# Altium schematic sheet BuoyLoRaNode_Schematic.SchDoc
size Letter
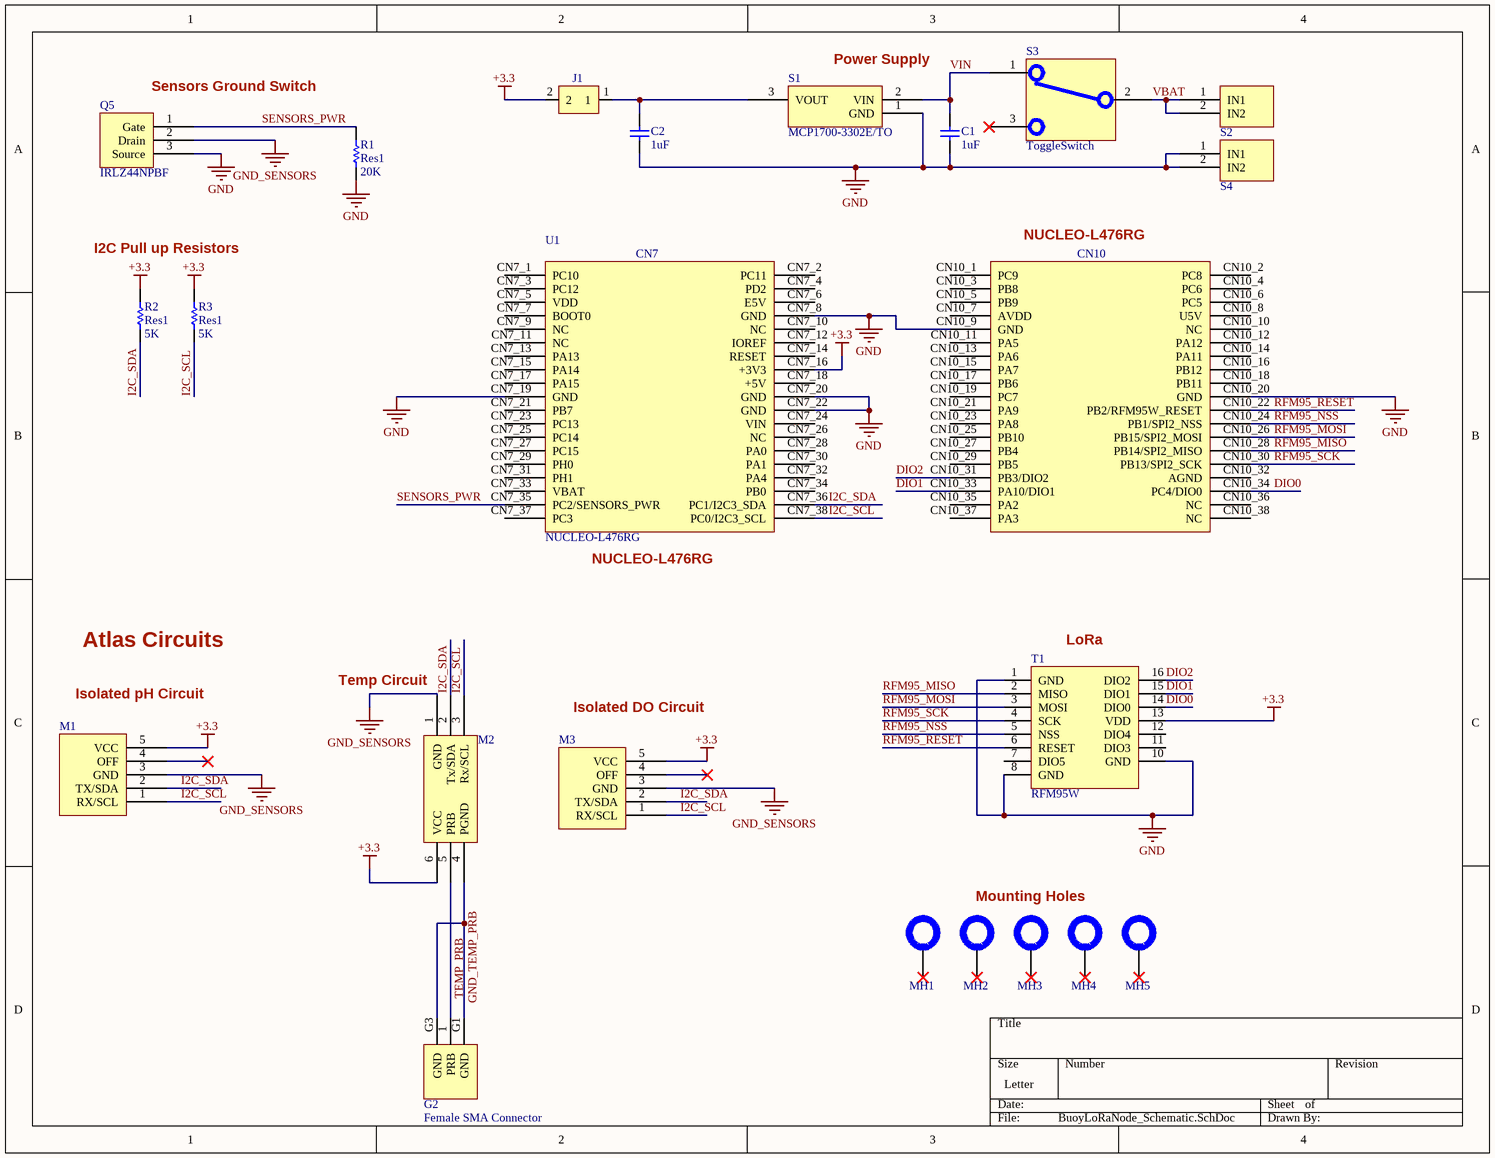
[diagram p0: BuoyLoRaNode_Schematic.SchDoc]

## Parts
C1  1uF  [C1uFTantalum]
C2  1uF  [C1uFTantalum]
G2  Female SMA Connector  [SmaFemaleConnectorEdgeMount]
J1  2PinMaleJumper  [2MaleJumper]  (value not drawn)
M1  Isolated pH Sensor  [ATLASISOLATEDPHSENSOR]  (value not drawn)
M2  EZO™ RTD Temperature Circuit  [AtlasTemperatureSensor]  (value not drawn)
M3  Isolated DO Sensor  [ATLASISOLATEDDOSENSOR]  (value not drawn)
MH1  MountingHole_3.4mmHole  [MountingHole]  (value not drawn)
MH2  MountingHole_3.4mmHole  [MountingHole]  (value not drawn)
MH3  MountingHole_3.4mmHole  [MountingHole]  (value not drawn)
MH4  MountingHole_3.4mmHole  [MountingHole]  (value not drawn)
MH5  MountingHole_3.4mmHole  [MountingHole]  (value not drawn)
Q5  IRLZ44NPBF  [IRLZ44N]
R1  Res1  value 20K  [AXIAL-0.3]
R2  Res1  value 5K  [AXIAL-0.3]
R3  Res1  value 5K  [AXIAL-0.3]
S1  MCP1700-3302E/TO  [MCP1700]
S2  2PositionScrewTerminal  [2POSITIONSCREWTERMINAL]  (value not drawn)
S3  ToggleSwitch  [ToggleSwitch]
S4  2PositionScrewTerminal  [2POSITIONSCREWTERMINAL]  (value not drawn)
T1  RFM95W  [RFM95WBreakout]
U1  NUCLEO-L476RG  [NUCLEOL476RG]

## Nets
+3.3: J1.2 M1.5(VCC) M2.6(VCC) M3.5(VCC) R2.2 R3.2 T1.13(VDD) U1.CN7_16(+3V3)
GND: C1.1 C2.1 Q5.3(Source) R1.1 S1.1(GND) S4.1(IN1) S4.2(IN2) T1.1(GND) T1.8(GND) T1.10(GND) U1.CN7_8(GND) U1.CN7_19(GND) U1.CN7_20(GND) U1.CN7_22(GND) U1.CN10_9(GND) U1.CN10_20(GND)
GND_SENSORS: M1.3(GND) M2.1(GND) M3.3(GND) Q5.2(Drain)
DIO0: T1.14(DIO0) U1.CN10_34(PC4/DIO0)
DIO1: T1.15(DIO1) U1.CN10_33(PA10/DIO1)
DIO2: T1.16(DIO2) U1.CN10_31(PB3/DIO2)
GND_TEMP_PRB: G2.G1(GND) G2.G3(GND) M2.4(PGND)
I2C_SCL: M1.1(RX/SCL) M2.3(Rx/SCL) M3.1(RX/SCL) R3.1 U1.CN7_38(PC0/I2C3_SCL)
I2C_SDA: M1.2(TX/SDA) M2.2(Tx/SDA) M3.2(TX/SDA) R2.1 U1.CN7_36(PC1/I2C3_SDA)
RFM95_MISO: T1.2(MISO) U1.CN10_28(PB14/SPI2_MISO)
RFM95_MOSI: T1.3(MOSI) U1.CN10_26(PB15/SPI2_MOSI)
RFM95_NSS: T1.5(NSS) U1.CN10_24(PB1/SPI2_NSS)
RFM95_RESET: T1.6(RESET) U1.CN10_22(PB2/RFM95W_RESET)
RFM95_SCK: T1.4(SCK) U1.CN10_30(PB13/SPI2_SCK)
SENSORS_PWR: Q5.1(Gate) R1.2 U1.CN7_35(PC2/SENSORS_PWR)
TEMP_PRB: G2.1(PRB) M2.5(PRB)
VBAT: S2.1(IN1) S2.2(IN2) S3.2(COM)
VIN: C1.2 S1.2(VIN) S3.1(L1)
NetC2_2: C2.2 J1.1 S1.3(VOUT)

Not connected (* = marked no-connect by the designer): M1 4(OFF)*; M3 4(OFF)*; MH1 1*; MH2 1*; MH3 1*; MH4 1*; MH5 1*; S3 3(L2)*; T1 7(DIO5) 11(DIO3) 12(DIO4); U1 CN7_1(PC10) CN7_2(PC11) CN7_3(PC12) CN7_4(PD2) CN7_5(VDD) CN7_6(E5V) CN7_7(BOOT0) CN7_9(NC) CN7_10(NC) CN7_11(NC) CN7_12(IOREF) CN7_13(PA13) CN7_14(RESET) CN7_15(PA14) CN7_17(PA15) CN7_18(+5V) CN7_21(PB7) CN7_23(PC13) CN7_24(VIN) CN7_25(PC14) CN7_26(NC) CN7_27(PC15) CN7_28(PA0) CN7_29(PH0) CN7_30(PA1) CN7_31(PH1) CN7_32(PA4) CN7_33(VBAT) CN7_34(PB0) CN7_37(PC3) CN10_1(PC9) CN10_2(PC8) CN10_3(PB8) CN10_4(PC6) CN10_5(PB9) CN10_6(PC5) CN10_7(AVDD) CN10_8(U5V) CN10_10(NC) CN10_11(PA5) CN10_12(PA12) CN10_13(PA6) CN10_14(PA11) CN10_15(PA7) CN10_16(PB12) CN10_17(PB6) CN10_18(PB11) CN10_19(PC7) CN10_21(PA9) CN10_23(PA8) CN10_25(PB10) CN10_27(PB4) CN10_29(PB5) CN10_32(AGND) CN10_35(PA2) CN10_36(NC) CN10_37(PA3) CN10_38(NC)

## Notes on the sheet
- (near Q5) Sensors Ground Switch
- (near S1) Power Supply
- (near U1) NUCLEO-L476RG
- I2C Pull up Resistors
- Atlas Circuits
- (near T1) LoRa
- (near M1) Isolated pH Circuit
- (near M2) Temp Circuit
- (near M3) Isolated DO Circuit
- Mounting Holes
- (in symbol NUCLEO-L476RG) CN7; CN10

## Library data of the parts
C1 C2 = T350A105K035AS7301: CAP TANT 1UF 10% 35V RADIAL; Manufacturer: KEMET; ESR (Equivalent Series Resistance): 8R; Leakage Current: 500nA; Polarity: Polar; Dissipation Factor: 3%; Lead Diameter: 0.5mm; Supplier 1: Digi-Key; Manufacturer Part Number: T350A105K035AS7301; RoHS: No; Category: Tantalum Capacitors; Stock 1: 8816; Pricing 1: 1=1.46000, 10=1.15200, 50=0.99820, 100=0.86380, 500=0.65264 (USD); Case/Package: Dipped; Min Operating Temperature: -55°C; Max Operating Temperature: 125°C; Packaging: Tape and Reel; Capacitance: 1uF; Voltage Rating: 35V; Tolerance: 10%; Voltage Rating (DC): 35V; Termination: Radial; Series: T35X; Construction: RADIAL; Diameter: 4.5mm; Height: 7.1mm; Lead Pitch: 2.54mm; RoHS Compliant: No; ComponentLink1URL: http://www.mouser.com/ds/2/212/F3100-1140474.pdf?src-supplier=Mouser; ComponentLink1Description: http://www.mouser.com/ds/2/212/F3100-1140474.pdf?src-supplier=Mouser; ComponentLink2URL: http://components.arrow.com/part/dataview/0323_00403401?src-supplier=Arrow+Europe; ComponentLink2Description: http://components.arrow.com/part/dataview/0323_00403401?src-supplier=Arrow+Europe; ComponentLink3URL: https://api.kemet.com/component-edge/download/datasheet/T350A105K035AS7301.pdf?src-supplier=Digi-Key; ComponentLink3Description: https://api.kemet.com/component-edge/download/datasheet/T350A105K035AS7301.pdf?src-supplier=Digi-Key; Supplier Part Number 1: 399-18004-1-ND
M1 = Atlas Isolated pH Sensor
M3 = Atlas Isolated DO Sensor
MH1-MH5 = MountingHole
Q5 = IRLZ44NPBF: INFINEON - IRLZ44NPBF - MOSFET, N, 55V, 41A, TO-220; Manufacturer: International Rectifier; Continuous Drain Current (ID): 47A; Gate to Source Voltage (Vgs): 16V; Rise Time: 84ns; Number of Elements: 1; Drain to Source Resistance: 35mR; Power Dissipation: 110W; Turn-On Delay Time: 11ns; Turn-Off Delay Time: 26ns; Fall Time: 15ns; Drain-source On Resistance-Max: 22mR; Input Capacitance: 1.7nF; Nominal Vgs: 2V; Recovery Time: 120ns; Element Configuration: Single; Supplier 1: Newark; Manufacturer Part Number: IRLZ44NPBF; RoHS: Yes; Category: MOSFETs; Mount: Through Hole; Case/Package: TO-220AB; Number of Pins: 3; Min Operating Temperature: -55°C; Max Operating Temperature: 175°C; Drain to Source Voltage (Vdss): 55V; Max Power Dissipation: 110W; Package Quantity: 50; Packaging: Rail/Tube; Rds On Max: 22mR; Drain to Source Breakdown Voltage: 55V; On-State Resistance: 22mR; Series: HEXFET®; Dual Supply Voltage: 55V; Voltage Rating (DC): 55V; Current Rating: 47A; Length: 10.54mm; Width: 4.69mm; Height: 8.77mm; Lead Pitch: 2.54mm; Radiation Hardening: No; RoHS Compliant: Yes; Lead Free: Lead Free; REACH SVHC: No SVHC; ComponentLink1URL: https://datasheet.ciiva.com/19479/1563905-19479714.pdf?src-supplier=Jameco; ComponentLink1Description: https://datasheet.ciiva.com/19479/1563905-19479714.pdf?src-supplier=Jameco; ComponentLink2URL: https://datasheet.ciiva.com/7459/irlz44n-7459241.pdf?src-supplier=Newark; ComponentLink2Description: https://datasheet.ciiva.com/7459/irlz44n-7459241.pdf?src-supplier=Newark; ComponentLink3URL: https://datasheet.ciiva.com/16427/irlz44npbf-16427676.pdf?src-supplier=Future+Electronics; ComponentLink3Description: https://datasheet.ciiva.com/16427/irlz44npbf-16427676.pdf?src-supplier=Future+Electronics; ComponentLink4URL: https://datasheet.ciiva.com/7835/irlz44npbf-7835815.pdf?src-supplier=Element14; ComponentLink4Description: https://datasheet.ciiva.com/7835/irlz44npbf-7835815.pdf?src-supplier=Element14; ComponentLink5URL: https://datasheet.ciiva.com/939/irlz44npbf-939116.pdf?src-supplier=Digi-Key; ComponentLink5Description: https://datasheet.ciiva.com/939/irlz44npbf-939116.pdf?src-supplier=Digi-Key; Supplier Part Number 1: 38K3030
R1-R3 = Res1: Resistor; Published: 8-Jun-2000; LatestRevisionDate: 17-Jul-2002; LatestRevisionNote: Re-released for DXP Platform.; PackageReference: AXIAL-0.3; Publisher: Altium Limited; PackageDescription: Axial Device, Thru-Hole; 2 Leads; 0.3 in Pin Spacing
S1 = MCP1700-3302E/TO: LDO Regulator Pos 3.3V 0.25A 3-Pin TO-92 Bag; Manufacturer: Microchip; Max Input Voltage: 6V; Min Input Voltage: 2.3V; Number of Outputs: 1; Output Type: Fixed; Output Current: 250mA; Input Bias Current: 1.6uA; Polarity: Positive; Quiescent Current: 4uA; Accuracy: 2%; Dropout Voltage: 178mV; Max Power Dissipation: 644mW; Supplier 1: RSComponents; Manufacturer Part Number: MCP1700-3302E/TO; RoHS: Yes; Category: Voltage Regulators - Linear; Stock 1: 1; Pricing 1: 10=0.41600, 30=0.39600, 100=0.36500 (USD); Mount: Through Hole; Case/Package: TO-92; Number of Pins: 3; Min Operating Temperature: -40°C; Max Operating Temperature: 125°C; Output Voltage: 3.3V; Nominal Output Voltage: 3.3V; Max Output Current: 250mA; Packaging: Bag; Package Quantity: 1000; Min Output Voltage: 3.3V; Output Voltage Accuracy: 2%; Power Dissipation: 644mW; Length: 0.205inch; Width: 0.165inch; Height: 0.21inch; Radiation Hardening: No; REACH SVHC: No SVHC; Lead Free: Lead Free; RoHS Compliant: Yes; ComponentLink1URL: https://datasheet.ciiva.com/15111/getdatasheetpartid-57068-15111255.pdf?src-supplier=Verical; ComponentLink1Description: https://datasheet.ciiva.com/15111/getdatasheetpartid-57068-15111255.pdf?src-supplier=Verical; ComponentLink2URL: https://datasheet.ciiva.com/2040/21826b-2040652.pdf?src-supplier=Digi-Key; ComponentLink2Description: https://datasheet.ciiva.com/2040/21826b-2040652.pdf?src-supplier=Digi-Key; ComponentLink3URL: https://datasheet.ciiva.com/7649/21826b-7649804.pdf?src-supplier=Element14; ComponentLink3Description: https://datasheet.ciiva.com/7649/21826b-7649804.pdf?src-supplier=Element14; ComponentLink4URL: https://datasheet.ciiva.com/8041/21826b-8041593.pdf?src-supplier=Element14; ComponentLink4Description: https://datasheet.ciiva.com/8041/21826b-8041593.pdf?src-supplier=Element14; ComponentLink5URL: https://datasheet.ciiva.com/17364/jp011779-17364271.pdf?src-supplier=Avnet+Europe; ComponentLink5Description: https://datasheet.ciiva.com/17364/jp011779-17364271.pdf?src-supplier=Avnet+Europe; ComponentLink6URL: https://datasheet.ciiva.com/16380/filehandler-aspxddocname-en011779-16380149.pdf?src-supplier=Future+Electronics; ComponentLink6Description: https://datasheet.ciiva.com/16380/filehandler-aspxddocname-en011779-16380149.pdf?src-supplier=Future+Electronics; ComponentLink7URL: https://datasheet.ciiva.com/14562/70045391-14562025.pdf?src-supplier=Allied+Electronics; ComponentLink7Description: https://datasheet.ciiva.com/14562/70045391-14562025.pdf?src-supplier=Allied+Electronics; Supplier Part Number 1: 0403888
S2 S4 = 2PositionScrewTerminal: PHOENIX CONTACT - 1725656 - Wire-To-Board Terminal Block, 2.54 mm, 2 Ways, 26 AWG, 20 AWG, 0.5 mm², Screw; Voltage Rating: 125V; Number of Contacts: 2; Max Current Rating: 6A; Number of Levels: 1; Max Supply Voltage: 63V; Connector Type: Screw,PCB,Terminal Block; Wire Gauge (Max): 26AWG; Wire Gauge (Min): 20AWG; Pitch: 2.54mm; Stripping Length: 4.5mm; Approvals: UL,CSA,cULus,EAC; Supplier 1: Digi-Key; Manufacturer: Phoenix Contact; Manufacturer Part Number: 1725656; RoHS: Yes; Category: Terminal Blocks; Stock 1: 9014; Pricing 1: 1=1.73000, 10=1.65600, 50=1.58400, 100=1.54080, 250=1.44000, 500=1.32480, 1000=1.22400, 2500=1.16640, 5000=1.10880 (USD); Mount: Through Hole; Number of Pins: 2; Color: Green; Weight: 0.022575oz; Contact Material: Tin; Housing Color: Green; Housing Material: Polyamide; Insulation Material: Nylon; Termination: Solder; Package Quantity: 50; Packaging: Bulk; Voltage: 125V; Series: MPT; Number of Rows: 1; Current Rating: 6A; Number of Positions Per Level: 2; Current: 6A; Number of Positions: 2; Orientation: Straight; Number of Poles: 2; Number of Circuits: 2; Length: 5.54mm; Width: 12mm; Height: 6.2mm; Depth: 6.2mm; Wire/Cable Gauge: 26AWG; Radiation Hardening: No; Lead Free: Lead Free; Flammability Rating: UL94 V-0; RoHS Compliant: Yes; REACH SVHC: No SVHC; ComponentLink1URL: https://datasheet.ciiva.com/823/1725656-823793.pdf?src-supplier=Digi-Key; ComponentLink1Description: https://datasheet.ciiva.com/823/1725656-823793.pdf?src-supplier=Digi-Key; ComponentLink2URL: https://datasheet.ciiva.com/1120/319957-1120510.pdf?src-supplier=Farnell; ComponentLink2Description: https://datasheet.ciiva.com/1120/319957-1120510.pdf?src-supplier=Farnell; ComponentLink3URL: https://datasheet.ciiva.com/16071/1725656-16071846.pdf?src-supplier=Onlinecomponents.com; ComponentLink3Description: https://datasheet.ciiva.com/16071/1725656-16071846.pdf?src-supplier=Onlinecomponents.com; ComponentLink4URL: https://datasheet.ciiva.com/15169/getdatasheetpartid-199323-15169849.pdf?src-supplier=Verical; ComponentLink4Description: https://datasheet.ciiva.com/15169/getdatasheetpartid-199323-15169849.pdf?src-supplier=Verical; ComponentLink5URL: https://datasheet.ciiva.com/26340/788052-da-01-en-100ntklemme-1725656-250-st-26340907.pdf?src-supplier=Conrad; ComponentLink5Description: https://datasheet.ciiva.com/26340/788052-da-01-en-100ntklemme-1725656-250-st-26340907.pdf?src-supplier=Conrad; Supplier Part Number 1: 277-1273-ND
T1 = RFM95W: RFM95W Breakout Board; Manufacturer: Molex; Color: White; Contact Resistance: 10mR; Number of Contacts: 6; Gender: Male; Current Rating: 4A; Voltage Rating: 250V; Insulation Resistance: 50GR; Connector Type: Male Pin; Pitch: 2.54mm; Glow Wire Compliant: Non-compliant; Manufacturer Part Number: 22-10-2061; RoHS: Yes; Category: Headers and Wire Housings; Stock 1: 3643; Pricing 1: 1=1.33000, 10=1.10400, 100=0.92000, 1000=0.73600, 5000=0.64400, 10000=0.61180 (USD); Mount: Through Hole; Contact Plating: Gold,Copper,Tin; Contact Material: Brass; Housing Color: Black; Housing Material: Nylon; Min Operating Temperature: 0°C; Max Operating Temperature: 75°C; Number of Rows: 1; Packaging: Bulk; Termination: Solder; Orientation: Straight; Package Quantity: 10; Number of Positions: 6; Voltage Rating (DC): 250V; Number of Circuits: 6; Series: KK® 4030; Contact Type: Male Pin; Length: 95mm; Height: 14.68mm; Depth: 9.02mm; Contact Mating Length: 0.295inch; Radiation Hardening: No; RoHS Compliant: Yes; REACH SVHC: Unknown; Halogen Free: Low Halogen; Flammability Rating: UL94 V-0; ComponentLink1URL: https://datasheet.ciiva.com/711/022032041-sd-711929.pdf?src-supplier=Digi-Key; ComponentLink1Description: https://datasheet.ciiva.com/711/022032041-sd-711929.pdf?src-supplier=Digi-Key; ComponentLink2URL: https://datasheet.ciiva.com/5158/0022102061-pcb-headers-158488-5158499.pdf?src-supplier=Mouser; ComponentLink2Description: https://datasheet.ciiva.com/5158/0022102061-pcb-headers-158488-5158499.pdf?src-supplier=Mouser; ComponentLink3URL: https://datasheet.ciiva.com/10086/0022102061-pcb-headers-10086323.pdf?src-supplier=Avnet; ComponentLink3Description: https://datasheet.ciiva.com/10086/0022102061-pcb-headers-10086323.pdf?src-supplier=Avnet; ComponentLink4URL: https://datasheet.ciiva.com/19461/1965971-19461525.pdf?src-supplier=Jameco; ComponentLink4Description: https://datasheet.ciiva.com/19461/1965971-19461525.pdf?src-supplier=Jameco; ComponentLink5URL: https://datasheet.ciiva.com/30196/0022102061-pcb-headers-30196683.pdf?src-supplier=Onlinecomponents.com; ComponentLink5Description: https://datasheet.ciiva.com/30196/0022102061-pcb-headers-30196683.pdf?src-supplier=Onlinecomponents.com; ComponentLink6URL: https://datasheet.ciiva.com/16727/0022102061-pcb-headers-16727098.pdf?src-supplier=Avnet+Europe; ComponentLink6Description: https://datasheet.ciiva.com/16727/0022102061-pcb-headers-16727098.pdf?src-supplier=Avnet+Europe; Supplier 1: Digi-Key; Supplier Part Number 1: 23-0022102081-ND
U1 = NUCLEO-L476RG: 16/32-BITS MICROS; Manufacturer: STMicroelectronics; Evaluation Kit: Yes; Core Architecture: ARM; Number of Bits: 32; Supplier 1: Digi-Key; Manufacturer Part Number: NUCLEO-L476RG; RoHS: Yes; Category: Embedded Processors and Controllers; Stock 1: 10; Pricing 1: 1=14.90000 (USD); REACH SVHC: No SVHC; Lead Free: Lead Free; ComponentLink1URL: http://www.farnell.com/datasheets/2308719.pdf?src-supplier=Farnell; ComponentLink1Description: http://www.farnell.com/datasheets/2308719.pdf?src-supplier=Farnell; ComponentLink2URL: http://www.st.com/content/ccc/resource/technical/document/datasheet/c5/ed/2f/60/aa/79/42/0b/DM00108832.pdf/files/DM00108832.pdf/jcr:content/translations/en.DM00108832.pdf?src-supplier=Digi-Key; ComponentLink2Description: http://www.st.com/content/ccc/resource/technical/document/datasheet/c5/ed/2f/60/aa/79/42/0b/DM00108832.pdf/files/DM00108832.pdf/jcr:content/translations/en.DM00108832.pdf?src-supplier=Digi-Key; ComponentLink3URL: http://www.farnell.com/datasheets/1947285.pdf?src-supplier=Element14; ComponentLink3Description: http://www.farnell.com/datasheets/1947285.pdf?src-supplier=Element14; Supplier Part Number 1: 497-15881-ND